# EAGLE design sense_pcb_c (EAGLE 9.6.2)
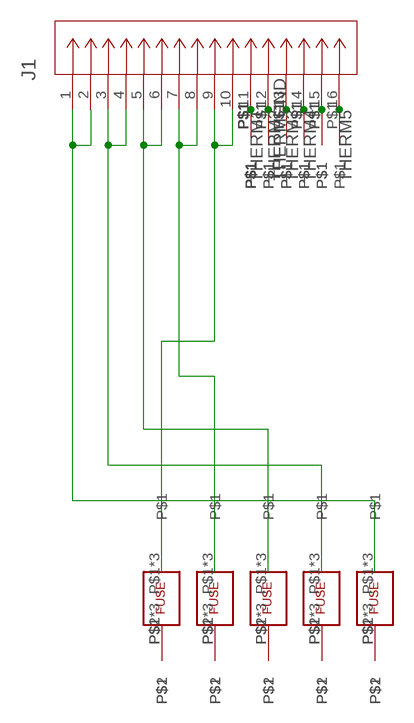
[diagram p0: schematic, sheet 1]

## Parts
J1  DF11-16DP-2DSA(01)  [CONN_DF11-16DP-2DSA(01)_HIR]
U$1  FUSE  [FUSE_PADS]
U$2  FUSE  [FUSE_PADS]
U$3  FUSE  [FUSE_PADS]
U$4  FUSE  [FUSE_PADS]
U$5  FUSE  [FUSE_PADS]
U$6  BB_CONTACT  [BB_CONTACT]
U$7  BB_CONTACT  [BB_CONTACT]
U$8  BB_CONTACT  [BB_CONTACT]
U$9  BB_CONTACT  [BB_CONTACT]
U$10  BB_CONTACT  [BB_CONTACT]
U$12  THERM_PIN  [THERM_PIN]
U$13  THERM_PIN  [THERM_PIN]
U$14  THERM_PIN  [THERM_PIN]
U$15  THERM_PIN  [THERM_PIN]
U$16  THERM_PIN  [THERM_PIN]
U$17  THERM_PIN  [THERM_PIN]
U$18  THERM_PIN  [THERM_PIN]
U$19  THERM_PIN  [THERM_PIN]
U$20  THERM_PIN  [THERM_PIN]
U$22  THERM_PIN  [THERM_PIN]
U$23  THERM_PIN  [THERM_PIN]
U$24  THERM_PIN  [THERM_PIN]
U$25  THERM_PIN  [THERM_PIN]
U$26  THERM_PIN  [THERM_PIN]
U$27  THERM_PIN  [THERM_PIN]
U$28  THERM_PIN  [THERM_PIN]
U$29  THERM_PIN  [THERM_PIN]
U$30  THERM_PIN  [THERM_PIN]

## Nets
N$1: J1.7 J1.8 U$2.P$1 U$2.P$3 U$2.P$5
N$2: U$1.P$2 U$1.P$4 U$1.P$6 U$6.P$1
N$3: J1.1 J1.2 U$5.P$1 U$5.P$3 U$5.P$5
N$4: U$2.P$2 U$2.P$4 U$2.P$6 U$7.P$1
N$5: U$5.P$2 U$5.P$4 U$5.P$6 U$10.P$1
N$6: U$3.P$2 U$3.P$4 U$3.P$6 U$8.P$1
N$7: J1.9 J1.10 U$1.P$1 U$1.P$3 U$1.P$5
N$8: U$4.P$2 U$4.P$4 U$4.P$6 U$9.P$1
N$10: J1.5 J1.6 U$3.P$1 U$3.P$3 U$3.P$5
N$11: J1.3 J1.4 U$4.P$1 U$4.P$3 U$4.P$5
THERM1: J1.12 U$22.P$1 U$23.P$1
THERM2: J1.13 U$24.P$1 U$25.P$1
THERM3: J1.14 U$26.P$1 U$27.P$1
THERM4: J1.15 U$28.P$1 U$29.P$1
THERM5: J1.16 U$30.P$1
THERMGND: J1.11 U$12.P$1 U$13.P$1 U$14.P$1 U$15.P$1 U$16.P$1 U$17.P$1 U$18.P$1 U$19.P$1 U$20.P$1

## Library data of the parts
J1 = sense_pcb_components:DF11-16DP-2DSA(01); COPYRIGHT: Copyright (C) 2023 Ultra Librarian. All rights reserved.; MANUFACTURER_PART_NUMBER: DF11-16DP-2DSA(01); MFR_NAME: Hirose
U$1-U$5 = sense_pcb_components:FUSE
U$6-U$10 = sense_pcb_components:BB_CONTACT
U$12-U$20 U$22-U$30 = sense_pcb_components:THERM_PIN

## Board
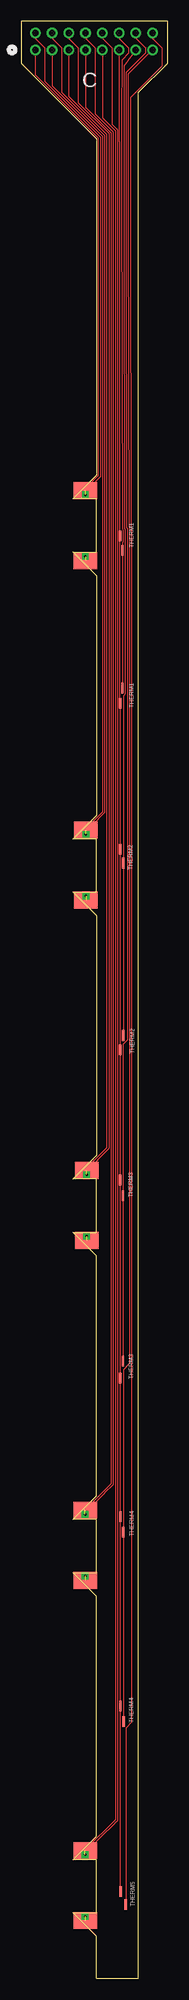
[diagram p1: board, top side]
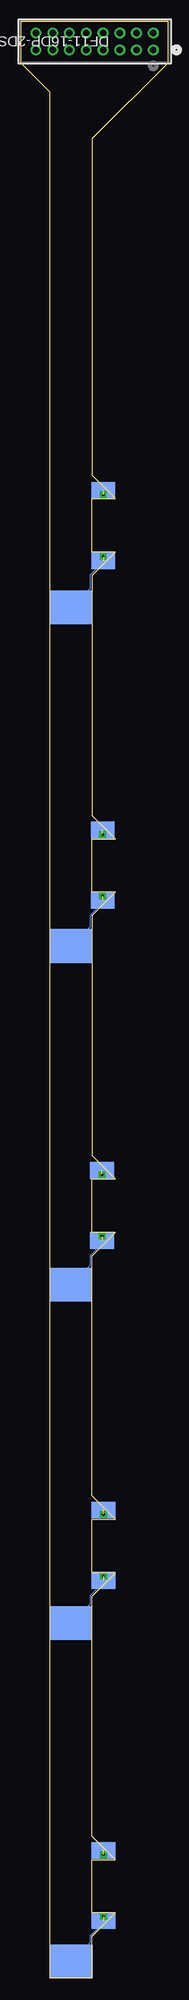
[diagram p2: board, bottom side, seen from below]

Size 17.5 x 233 mm. Coordinates in mm from the lower left corner, seen from the top.
Outline: 9,88.8 9,95.15 6.2,95.15 9,97.95 9,126.5 6.2,129.3 9,129.3 9,135.65 6.2,135.65 9,138.45 9,167 6.2,169.8 9,169.8 9,176.15 6.2,176.15 9,178.95 9,219 0,228 0,233 17.5,233 17.5,228 14,224.5 14,0 9,0 9,5 6.2,7.8 9,7.8 9,14.15 6.2,14.15 9,16.95 9,45.5 6.2,48.3 9,48.3 9,54.65 6.2,54.65 9,57.45 9,86 6.2,88.8 9,88.8
Copper layers (1*16): Top 0.035mm / dielectric 1.5mm / Bottom 0.035mm
Design rules "small_traces": minimum track width 5mil, minimum drill 0.2mm, track to track 5mil, track to pad 5mil, pad to pad 5mil, via to via 5mil, smd to smd 5mil, copper to edge 6mil, drill to drill 6mil, minimum pad ring 10mil, minimum via ring 0.13mm, stop-mask expansion 4mil, vias tented up to drill 0mil, thermal gap 10mil

### Footprints (pad centres in the part's own frame; a part is rotated, then mirrored left to right if it is on the bottom)
CONN_DF11-16DP-2DSA(01)_HIR = drill 0.762 pad 1.27: 1 0,0; 2 0,-2.007; 3 2.007,0; 4 2.007,-2.007; 5 3.988,0; 6 3.988,-2.007; 7 5.994,0; 8 5.994,-2.007; 9 8.001,0; 10 8.001,-2.007; 11 10.008,0; 12 10.008,-2.007; 13 11.989,0; 14 11.989,-2.007; 15 13.995,0; 16 13.995,-2.007
FUSE_PADS = smd 2.8 x 2 bottom: P$1 0,0; P$2 0,8.35 | smd 2.8 x 2: P$3 0,0; P$4 0,8.35 | drill 0.305 square: P$5 0,0.508; P$6 0,7.842
BB_CONTACT = smd 5 x 4: P$1 0,0
THERM_PIN = smd 0.279 x 1.27: P$1 0,0

### Placement (x,y rotation side)
J1  1.71,229.57 180 bottom
U$1  7.65,15.24 180 top
U$2  7.65,55.75 180 top
U$3  7.83,96.19 180 top
U$4  7.76,136.7 180 top
U$5  7.68,177.11 180 top
U$6  11.49,2.03 0 bottom
U$7  11.54,42.3 0 bottom
U$8  11.54,82.6 0 bottom
U$9  11.54,122.9 0 bottom
U$10  11.54,163.2 0 bottom
U$12  11.84,171.7 0 top
U$13  11.84,151.79 0 top
U$14  11.84,134.42 0 top
U$15  11.84,110.57 0 top
U$16  11.84,95.05 0 top
U$17  11.84,71.45 0 top
U$18  11.87,54.99 0 top
U$19  11.87,32.44 0 top
U$20  11.9,10.36 0 top
U$22  12.1,170 0 top
U$23  12.1,153.59 0 top
U$24  12.2,132.77 0 top
U$25  12.2,112.24 0 top
U$26  12.18,73.48 0 top
U$27  12.18,93.19 0 top
U$28  12.2,53.14 0 top
U$29  12.25,30.58 0 top
U$30  12.51,8.79 0 top

### Tracks (layer width: path | path; a pad name or v marks a point on that pad's centre or on a via)
N$1  (2 unrouted)
  Top 0.127: J1.7 7.71,222.76 10.74,219.72 10.74,58.88 7.65,55.8 U$2.P$5 9.18,56.97 | J1.8 7.71,230.96 8.84,229.83 8.84,221.99 10.99,219.83 10.99,58.78 9.99,57.77 9.99,57.76 9.97,57.76 9.18,56.97 | 9.18,56.97 9.15,56.93
N$2  (2 unrouted)
  Bottom 0.127: U$6.P$1 9.22,4.3 9.22,5.09 7.65,6.65 U$1.P$6
N$3  (2 unrouted)
  Top 0.127: J1.1 1.71,226.6 9.22,219.09 9.22,178.86 7.68,177.32 U$5.P$5 9.02,178.31 9.47,178.75 9.47,219.19 2.84,225.82 2.84,229.83 1.71,230.96 J1.2
N$4  (2 unrouted)
  Bottom 0.127: U$7.P$1 9.22,44.62 9.22,45.59 7.65,47.15 U$2.P$6
N$5  (2 unrouted)
  Bottom 0.127: U$10.P$1 9.22,165.52 9.22,167.09 7.68,168.63 U$5.P$6
N$6  (2 unrouted)
  Bottom 0.127: U$8.P$1 9.22,84.92 9.22,86.09 7.83,87.47 U$3.P$6
N$7  (2 unrouted)
  Top 0.127: J1.9 9.71,221.47 11.25,219.93 11.25,18.89 7.65,15.3 U$1.P$5 9.14,16.42 11.5,18.79 11.5,220.04 10.84,220.7 10.84,229.83 9.71,230.96 J1.10
N$8  (2 unrouted)
  Bottom 0.127: U$9.P$1 9.22,125.22 9.22,126.59 7.75,128.05 U$4.P$6
N$10  (2 unrouted)
  Top 0.127: J1.5 5.7,224.04 10.23,219.51 10.23,98.88 7.83,96.48 U$3.P$5 9.25,97.54 | J1.6 5.7,230.96 6.83,229.83 6.83,223.27 10.49,219.62 10.49,98.77 9.25,97.54 | 9.25,97.54 9.1,97.38
N$11  (2 unrouted)
  Top 0.127: J1.3 3.72,225.31 9.72,219.3 9.72,138.87 7.75,136.9 U$4.P$5 9.32,138.11 | J1.4 3.72,230.96 4.85,229.83 4.85,224.54 9.98,219.41 9.98,138.76 9.32,138.11 | 9.32,138.11 9.11,137.89
THERM1
  Top 0.127: J1.12 11.72,230.96 12.85,229.83 12.85,229.15 12.02,228.32 12.01,221.79 12.01,213.36 12.09,172.5 12.18,172.42 12.18,170.99 12.1,170.91 U$22.P$1 U$23.P$1
THERM2
  Top 0.127: J1.13 12.28,227.59 12.27,226.85 12.27,209.28 12.35,172.6 12.43,172.52 12.43,152.88 12.2,152.65 U$24.P$1 U$25.P$1
THERM3
  Top 0.127: J1.14 13.7,230.96 14.83,229.83 14.83,229.15 12.53,226.85 12.53,209.28 12.6,172.71 12.68,172.63 12.68,111.68 12.18,111.17 U$27.P$1 U$26.P$1
THERM4
  Top 0.127: J1.15 12.78,226.64 12.78,209.28 12.86,172.81 12.94,172.73 12.94,73.2 12.2,72.46 U$28.P$1 U$29.P$1
THERM5
  Top 0.127: J1.16 15.71,230.96 16.84,229.83 16.84,227.64 13.04,223.84 13.04,209.28 13.11,172.92 13.19,172.84 13.19,30.48 12.5,29.79 U$30.P$1
THERMGND
  Top 0.127: U$20.P$1 U$19.P$1 U$18.P$1 U$17.P$1 U$16.P$1 U$15.P$1 U$14.P$1 U$13.P$1 11.77,151.87 11.77,171.45 | 11.77,171.45 11.77,171.63 U$12.P$1 | 11.77,171.45 11.76,218.62 11.76,220.96 11.77,229.35 J1.11

### Text on the board
tPlace: C | THERM1 | THERM1 | THERM2 | THERM2 | THERM3 | THERM3 | THERM4 | THERM4 | THERM5